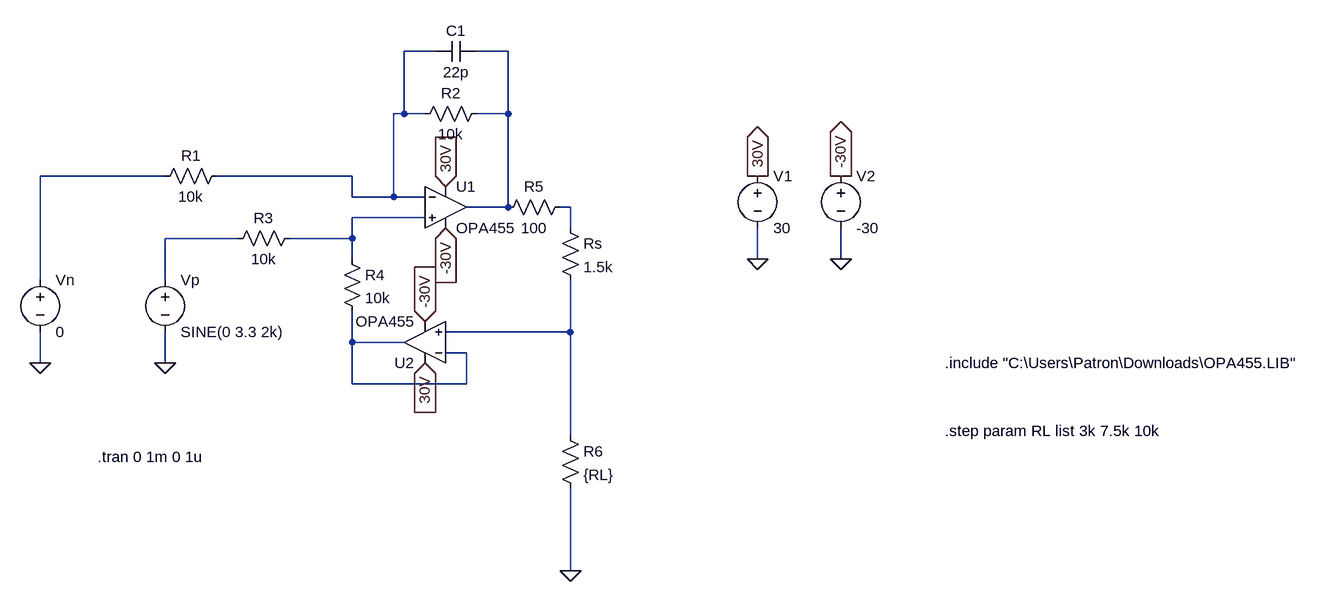
[diagram p0: schematic SP26_StimtheBrim_HowlandCurrentSourceSim_IsabelWilmot .asc]
SP26_StimtheBrim_HowlandCurrentSourceSim_IsabelWilmot .asc, the LTspice schematic file:
Version 4.1
SHEET 1 1988 680
WIRE 592 -176 544 -176
WIRE 704 -176 656 -176
WIRE 544 -80 544 -176
WIRE 544 -80 528 -80
WIRE 576 -80 544 -80
WIRE 704 -80 704 -176
WIRE 704 -80 656 -80
WIRE 176 16 -16 16
WIRE 464 16 256 16
WIRE 464 48 464 16
WIRE 528 48 528 -80
WIRE 528 48 464 48
WIRE 576 48 528 48
WIRE 704 64 704 -80
WIRE 704 64 640 64
WIRE 800 64 784 64
WIRE 576 80 464 80
WIRE 800 96 800 64
WIRE 288 112 176 112
WIRE 464 112 464 80
WIRE 464 112 368 112
WIRE 464 144 464 112
WIRE 1088 144 1088 96
WIRE 1216 144 1216 96
WIRE -16 176 -16 16
WIRE 176 176 176 112
WIRE 800 256 800 176
WIRE 800 256 608 256
WIRE 464 272 464 224
WIRE 544 272 464 272
WIRE 640 288 608 288
WIRE -16 304 -16 256
WIRE 176 304 176 256
WIRE 464 336 464 272
WIRE 640 336 640 288
WIRE 640 336 464 336
WIRE 800 416 800 256
WIRE 800 624 800 496
FLAG -16 304 0
FLAG 176 304 0
FLAG 1088 144 0
FLAG 1216 144 0
FLAG 1088 16 30V
IOPIN 1088 16 Out
FLAG 1216 16 -30V
IOPIN 1216 16 Out
FLAG 608 32 30V
IOPIN 608 32 In
FLAG 608 96 -30V
IOPIN 608 96 In
FLAG 576 304 30V
IOPIN 576 304 In
FLAG 576 240 -30V
IOPIN 576 240 In
FLAG 800 624 0
SYMBOL voltage -16 160 R0
WINDOW 123 0 0 Left 0
WINDOW 39 0 0 Left 0
SYMATTR InstName Vn
SYMATTR Value 0
SYMBOL voltage 176 160 R0
WINDOW 123 0 0 Left 0
WINDOW 39 0 0 Left 0
SYMATTR InstName Vp
SYMATTR Value SINE(0 3.3 2k)
SYMBOL res 272 0 R90
WINDOW 0 0 56 VBottom 2
WINDOW 3 32 56 VTop 2
SYMATTR InstName R1
SYMATTR Value 10k
SYMBOL res 384 96 R90
WINDOW 0 0 56 VBottom 2
WINDOW 3 32 56 VTop 2
SYMATTR InstName R3
SYMATTR Value 10k
SYMBOL res 784 80 R0
SYMATTR InstName Rs
SYMATTR Value 1.5k
SYMBOL res 672 -96 R90
WINDOW 0 0 56 VBottom 2
WINDOW 3 32 56 VTop 2
SYMATTR InstName R2
SYMATTR Value 10k
SYMBOL voltage 1088 0 R0
WINDOW 123 0 0 Left 0
WINDOW 39 0 0 Left 0
SYMATTR InstName V1
SYMATTR Value 30
SYMBOL voltage 1216 0 R0
WINDOW 123 0 0 Left 0
WINDOW 39 0 0 Left 0
SYMATTR InstName V2
SYMATTR Value -30
SYMBOL res 448 128 R0
SYMATTR InstName R4
SYMATTR Value 10k
SYMBOL OpAmps\\opamp2 608 0 R0
SYMATTR InstName U1
SYMATTR Value OPA455
SYMBOL OpAmps\\opamp2 576 336 R180
SYMATTR InstName U2
SYMATTR Value OPA455
SYMBOL cap 656 -192 R90
WINDOW 0 0 32 VBottom 2
WINDOW 3 32 32 VTop 2
SYMATTR InstName C1
SYMATTR Value 22p
SYMBOL res 800 48 R90
WINDOW 0 0 56 VBottom 2
WINDOW 3 32 56 VTop 2
SYMATTR InstName R5
SYMATTR Value 100
SYMBOL res 784 400 R0
SYMATTR InstName R6
SYMATTR Value {RL}
TEXT 72 448 Left 2 !.tran 0 1m 0 1u
TEXT 1376 304 Left 2 !.include "C:\\Users\\Patron\\Downloads\\OPA455.LIB"
TEXT 1376 408 Left 2 !.step param RL list 3k 7.5k 10k

The netlist it stands for:
* SP26_StimtheBrim_HowlandCurrentSourceSim_IsabelWilmot .asc
Vn N003 0 0
Vp N006 0 SINE(0 3.3 2k)
R1 N001 N003 10k
R3 N005 N006 10k
Rs N004 N007 1.5k
R2 N002 N001 10k
V1 30V 0 30
V2 -30V 0 -30
R4 N005 N008 10k
X§U1 N005 N001 30V -30V N002 OPA455  ; pins In+ In- V+ V- OUT
X§U2 N007 N008 30V -30V N008 OPA455  ; pins In+ In- V+ V- OUT
C1 N002 N001 22p
R5 N004 N002 100
R6 N007 0 {RL}
.tran 0 1m 0 1u
.include "C:\Users\Patron\Downloads\OPA455.LIB"
.step param RL list 3k 7.5k 10k
.backanno
.end